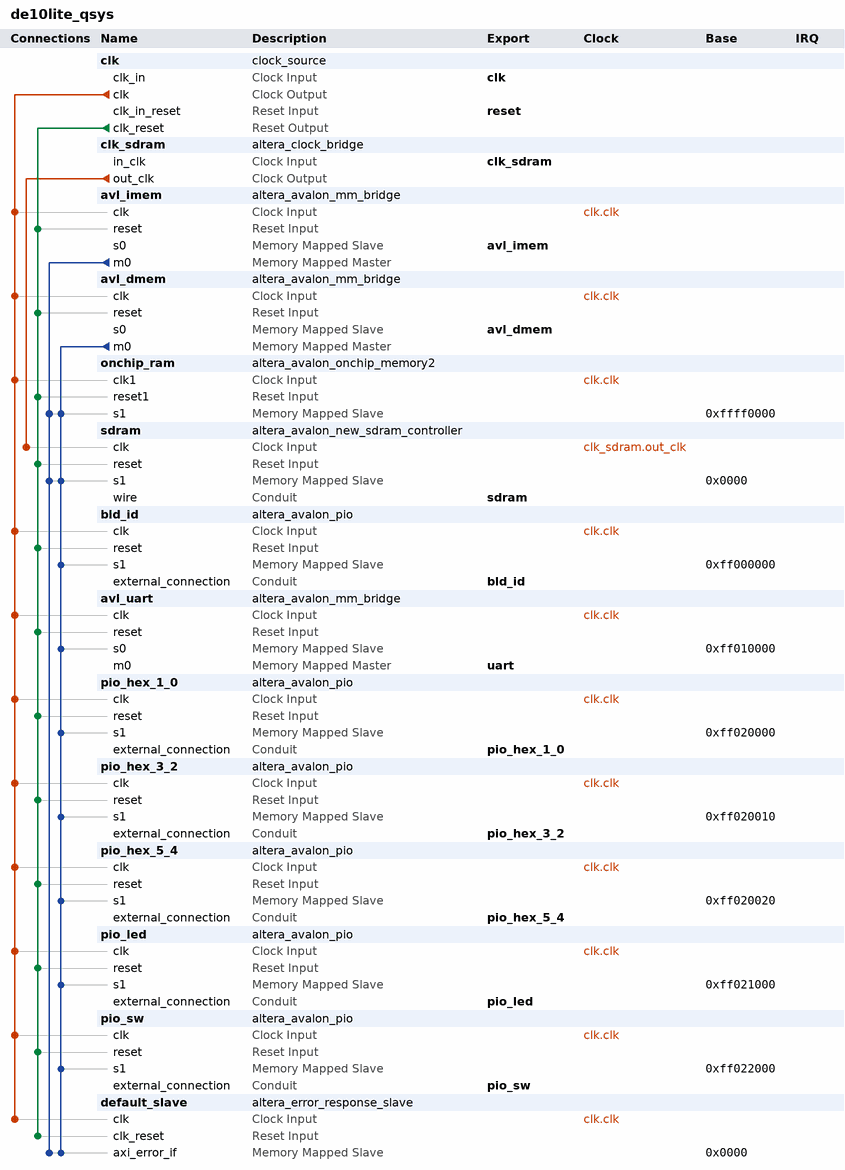
[diagram p0: system contents]
# Platform Designer (Qsys) system de10lite_qsys, Cyclone IV E EP4CE115F29C7
# Parameters at their usual value, and those the tool derives, are not listed.
package require -exact qsys 17.1
create_system de10lite_qsys
set_project_property DEVICE_FAMILY {Cyclone IV E}
set_project_property DEVICE EP4CE115F29C7

add_instance clk clock_source 17.1
set_instance_parameter_value clk clockFrequency 20000000

add_instance clk_sdram altera_clock_bridge 17.1
set_instance_parameter_value clk_sdram DERIVED_CLOCK_RATE 0
set_instance_parameter_value clk_sdram EXPLICIT_CLOCK_RATE 100000000

add_instance avl_imem altera_avalon_mm_bridge 17.1
set_instance_parameter_value avl_imem ADDRESS_UNITS SYMBOLS
set_instance_parameter_value avl_imem ADDRESS_WIDTH 32
set_instance_parameter_value avl_imem DATA_WIDTH 32
set_instance_parameter_value avl_imem MAX_PENDING_RESPONSES 1
set_instance_parameter_value avl_imem USE_AUTO_ADDRESS_WIDTH 0
set_instance_parameter_value avl_imem USE_RESPONSE 1

add_instance avl_dmem altera_avalon_mm_bridge 17.1
set_instance_parameter_value avl_dmem ADDRESS_UNITS SYMBOLS
set_instance_parameter_value avl_dmem ADDRESS_WIDTH 32
set_instance_parameter_value avl_dmem DATA_WIDTH 32
set_instance_parameter_value avl_dmem MAX_PENDING_RESPONSES 1
set_instance_parameter_value avl_dmem USE_AUTO_ADDRESS_WIDTH 0
set_instance_parameter_value avl_dmem USE_RESPONSE 1

add_instance onchip_ram altera_avalon_onchip_memory2 17.1
set_instance_parameter_value onchip_ram dataWidth 64
set_instance_parameter_value onchip_ram dualPort false
set_instance_parameter_value onchip_ram initMemContent true
set_instance_parameter_value onchip_ram initializationFileName E:/scr1_debug/fpga/riscv-rlwe-sdk/fpga/de10lite/scr1/ip/de10lite.hex
set_instance_parameter_value onchip_ram memorySize 65536
set_instance_parameter_value onchip_ram resetrequest_enabled false
set_instance_parameter_value onchip_ram useNonDefaultInitFile true

add_instance sdram altera_avalon_new_sdram_controller 17.1
set_instance_parameter_value sdram TAC 5.4
set_instance_parameter_value sdram TRCD 15.0
set_instance_parameter_value sdram TRP 15.0
set_instance_parameter_value sdram casLatency 3
set_instance_parameter_value sdram columnWidth 10
set_instance_parameter_value sdram dataWidth 16
set_instance_parameter_value sdram generateSimulationModel false
set_instance_parameter_value sdram model single_Micron_MT48LC4M32B2_7_chip
set_instance_parameter_value sdram numberOfBanks 4
set_instance_parameter_value sdram numberOfChipSelects 1
set_instance_parameter_value sdram powerUpDelay 100.0
set_instance_parameter_value sdram refreshPeriod 7.8125
set_instance_parameter_value sdram rowWidth 13

add_instance bld_id altera_avalon_pio 17.1
set_instance_parameter_value bld_id direction Input
set_instance_parameter_value bld_id simDoTestBenchWiring true
set_instance_parameter_value bld_id simDrivenValue 3738876602
set_instance_parameter_value bld_id width 32

add_instance avl_uart altera_avalon_mm_bridge 17.1
set_instance_parameter_value avl_uart ADDRESS_UNITS SYMBOLS
set_instance_parameter_value avl_uart ADDRESS_WIDTH 5
set_instance_parameter_value avl_uart DATA_WIDTH 32
set_instance_parameter_value avl_uart MAX_PENDING_RESPONSES 1
set_instance_parameter_value avl_uart PIPELINE_COMMAND 0
set_instance_parameter_value avl_uart PIPELINE_RESPONSE 0
set_instance_parameter_value avl_uart USE_AUTO_ADDRESS_WIDTH 0

add_instance pio_hex_1_0 altera_avalon_pio 17.1
set_instance_parameter_value pio_hex_1_0 direction Output
set_instance_parameter_value pio_hex_1_0 resetValue 65535
set_instance_parameter_value pio_hex_1_0 width 16

add_instance pio_hex_3_2 altera_avalon_pio 17.1
set_instance_parameter_value pio_hex_3_2 direction Output
set_instance_parameter_value pio_hex_3_2 resetValue 65535
set_instance_parameter_value pio_hex_3_2 width 16

add_instance pio_hex_5_4 altera_avalon_pio 17.1
set_instance_parameter_value pio_hex_5_4 direction Output
set_instance_parameter_value pio_hex_5_4 resetValue 65535
set_instance_parameter_value pio_hex_5_4 width 16

add_instance pio_led altera_avalon_pio 17.1
set_instance_parameter_value pio_led direction Output
set_instance_parameter_value pio_led width 10

add_instance pio_sw altera_avalon_pio 17.1
set_instance_parameter_value pio_sw direction Input
set_instance_parameter_value pio_sw simDoTestBenchWiring true
set_instance_parameter_value pio_sw width 10

add_instance default_slave altera_error_response_slave 17.1
set_instance_parameter_value default_slave AXI_ADDR_W 32
set_instance_parameter_value default_slave AXI_DATA_W 32
set_instance_parameter_value default_slave AXI_ID_W 4
set_instance_parameter_value default_slave LOG_CSR_DEPTH 1
set_instance_parameter_value default_slave REGISTER_AV_INPUTS 0
set_instance_parameter_value default_slave SUPPORT_CSR 0

# connections
add_connection clk.clk avl_dmem.clk clock
add_connection clk.clk avl_imem.clk clock
add_connection clk.clk avl_uart.clk clock
add_connection clk.clk bld_id.clk clock
add_connection clk.clk default_slave.clk clock
add_connection clk.clk onchip_ram.clk1 clock
add_connection clk.clk pio_hex_1_0.clk clock
add_connection clk.clk pio_hex_3_2.clk clock
add_connection clk.clk pio_hex_5_4.clk clock
add_connection clk.clk pio_led.clk clock
add_connection clk.clk pio_sw.clk clock
add_connection clk_sdram.out_clk sdram.clk clock
add_connection clk.clk_reset avl_dmem.reset reset
add_connection clk.clk_reset avl_imem.reset reset
add_connection clk.clk_reset avl_uart.reset reset
add_connection clk.clk_reset bld_id.reset reset
add_connection clk.clk_reset default_slave.clk_reset reset
add_connection clk.clk_reset onchip_ram.reset1 reset
add_connection clk.clk_reset pio_hex_1_0.reset reset
add_connection clk.clk_reset pio_hex_3_2.reset reset
add_connection clk.clk_reset pio_hex_5_4.reset reset
add_connection clk.clk_reset pio_led.reset reset
add_connection clk.clk_reset pio_sw.reset reset
add_connection clk.clk_reset sdram.reset reset
add_connection avl_dmem.m0 avl_uart.s0 avalon
set_connection_parameter_value avl_dmem.m0/avl_uart.s0 baseAddress 0xff010000
add_connection avl_dmem.m0 bld_id.s1 avalon
set_connection_parameter_value avl_dmem.m0/bld_id.s1 baseAddress 0xff000000
add_connection avl_dmem.m0 default_slave.axi_error_if avalon
set_connection_parameter_value avl_dmem.m0/default_slave.axi_error_if baseAddress 0x0000
set_connection_parameter_value avl_dmem.m0/default_slave.axi_error_if defaultConnection true
add_connection avl_dmem.m0 onchip_ram.s1 avalon
set_connection_parameter_value avl_dmem.m0/onchip_ram.s1 baseAddress 0xffff0000
add_connection avl_dmem.m0 pio_hex_1_0.s1 avalon
set_connection_parameter_value avl_dmem.m0/pio_hex_1_0.s1 baseAddress 0xff020000
add_connection avl_dmem.m0 pio_hex_3_2.s1 avalon
set_connection_parameter_value avl_dmem.m0/pio_hex_3_2.s1 baseAddress 0xff020010
add_connection avl_dmem.m0 pio_hex_5_4.s1 avalon
set_connection_parameter_value avl_dmem.m0/pio_hex_5_4.s1 baseAddress 0xff020020
add_connection avl_dmem.m0 pio_led.s1 avalon
set_connection_parameter_value avl_dmem.m0/pio_led.s1 baseAddress 0xff021000
add_connection avl_dmem.m0 pio_sw.s1 avalon
set_connection_parameter_value avl_dmem.m0/pio_sw.s1 baseAddress 0xff022000
add_connection avl_dmem.m0 sdram.s1 avalon
set_connection_parameter_value avl_dmem.m0/sdram.s1 baseAddress 0x0000
add_connection avl_imem.m0 default_slave.axi_error_if avalon
set_connection_parameter_value avl_imem.m0/default_slave.axi_error_if baseAddress 0x0000
set_connection_parameter_value avl_imem.m0/default_slave.axi_error_if defaultConnection true
add_connection avl_imem.m0 onchip_ram.s1 avalon
set_connection_parameter_value avl_imem.m0/onchip_ram.s1 baseAddress 0xffff0000
add_connection avl_imem.m0 sdram.s1 avalon
set_connection_parameter_value avl_imem.m0/sdram.s1 baseAddress 0x0000

# exported interfaces
add_interface avl_dmem avalon slave
set_interface_property avl_dmem EXPORT_OF avl_dmem.s0
add_interface avl_imem avalon slave
set_interface_property avl_imem EXPORT_OF avl_imem.s0
add_interface bld_id conduit end
set_interface_property bld_id EXPORT_OF bld_id.external_connection
add_interface clk clock sink
set_interface_property clk EXPORT_OF clk.clk_in
add_interface clk_sdram clock sink
set_interface_property clk_sdram EXPORT_OF clk_sdram.in_clk
add_interface pio_hex_1_0 conduit end
set_interface_property pio_hex_1_0 EXPORT_OF pio_hex_1_0.external_connection
add_interface pio_hex_3_2 conduit end
set_interface_property pio_hex_3_2 EXPORT_OF pio_hex_3_2.external_connection
add_interface pio_hex_5_4 conduit end
set_interface_property pio_hex_5_4 EXPORT_OF pio_hex_5_4.external_connection
add_interface pio_led conduit end
set_interface_property pio_led EXPORT_OF pio_led.external_connection
add_interface pio_sw conduit end
set_interface_property pio_sw EXPORT_OF pio_sw.external_connection
add_interface reset reset sink
set_interface_property reset EXPORT_OF clk.clk_in_reset
add_interface sdram conduit end
set_interface_property sdram EXPORT_OF sdram.wire
add_interface uart avalon master
set_interface_property uart EXPORT_OF avl_uart.m0

set_interconnect_requirement {$system} qsys_mm.clockCrossingAdapter AUTO
set_interconnect_requirement {$system} qsys_mm.maxAdditionalLatency 0

save_system de10lite_qsys.qsys
